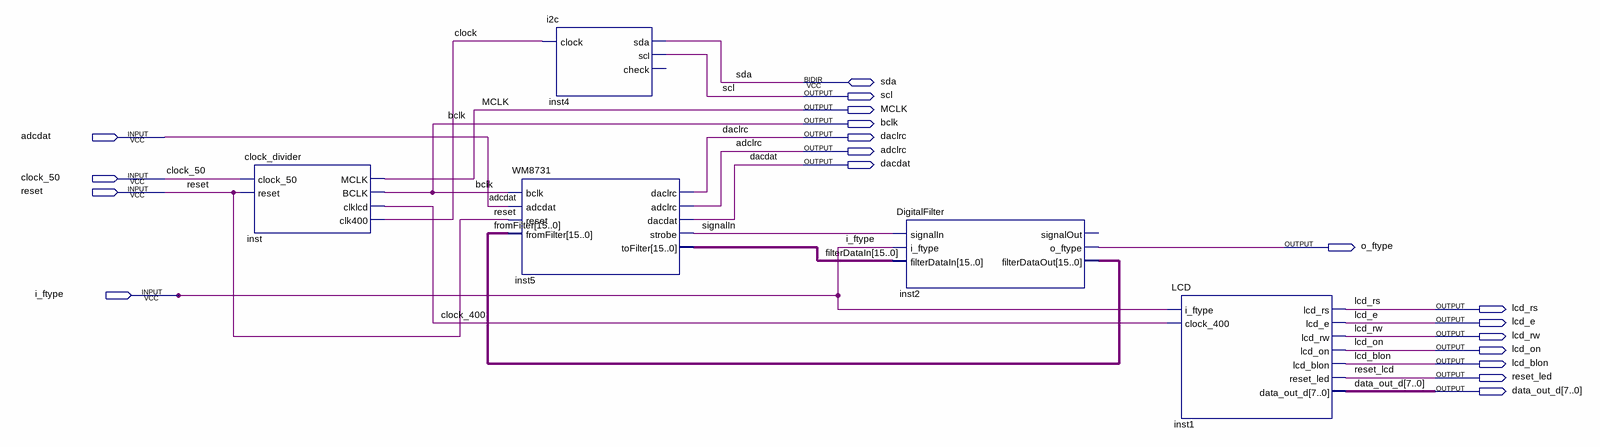
[diagram p0: schematic sheet]
// Quartus schematic Main.bdf as structural Verilog: 5 symbols, 19 pins
module Main (
  input  adcdat,
  input  clock_50,
  input  reset,
  input  i_ftype,
  inout  sda,
  output scl,
  output MCLK,
  output bclk,
  output daclrc,
  output adclrc,
  output dacdat,
  output o_ftype,
  output lcd_rs,
  output lcd_e,
  output lcd_rw,
  output lcd_on,
  output lcd_blon,
  output reset_led,
  output [7:0] data_out_d
);

  wire clock, clock_400, signalIn;
  wire [15:0] filterDataIn, fromFilter;

  clock_divider inst (.clock_50(clock_50), .reset(reset), .MCLK(MCLK), .BCLK(bclk), .clklcd(clock_400), .clk400(clock));
  WM8731 inst5 (
    .bclk(bclk), .adcdat(adcdat), .reset(reset), .fromFilter(fromFilter), .daclrc(daclrc), .adclrc(adclrc),
    .dacdat(dacdat), .strobe(signalIn), .toFilter(filterDataIn));
  i2c inst4 (.clock(clock), .scl(scl), .sda(sda));  // open: check
  DigitalFilter inst2 (
    .signalIn(signalIn), .i_ftype(i_ftype), .filterDataIn(filterDataIn), .o_ftype(o_ftype),
    .filterDataOut(fromFilter));  // open: signalOut
  LCD inst1 (
    .i_ftype(i_ftype), .clock_400(clock_400), .lcd_rs(lcd_rs), .lcd_e(lcd_e), .lcd_rw(lcd_rw),
    .lcd_on(lcd_on), .lcd_blon(lcd_blon), .reset_led(reset_led), .data_out_d(data_out_d));

  // Other names for the same wires on the sheet: reset_lcd = reset_led
endmodule
